# EAGLE design supply (EAGLE 5.10)
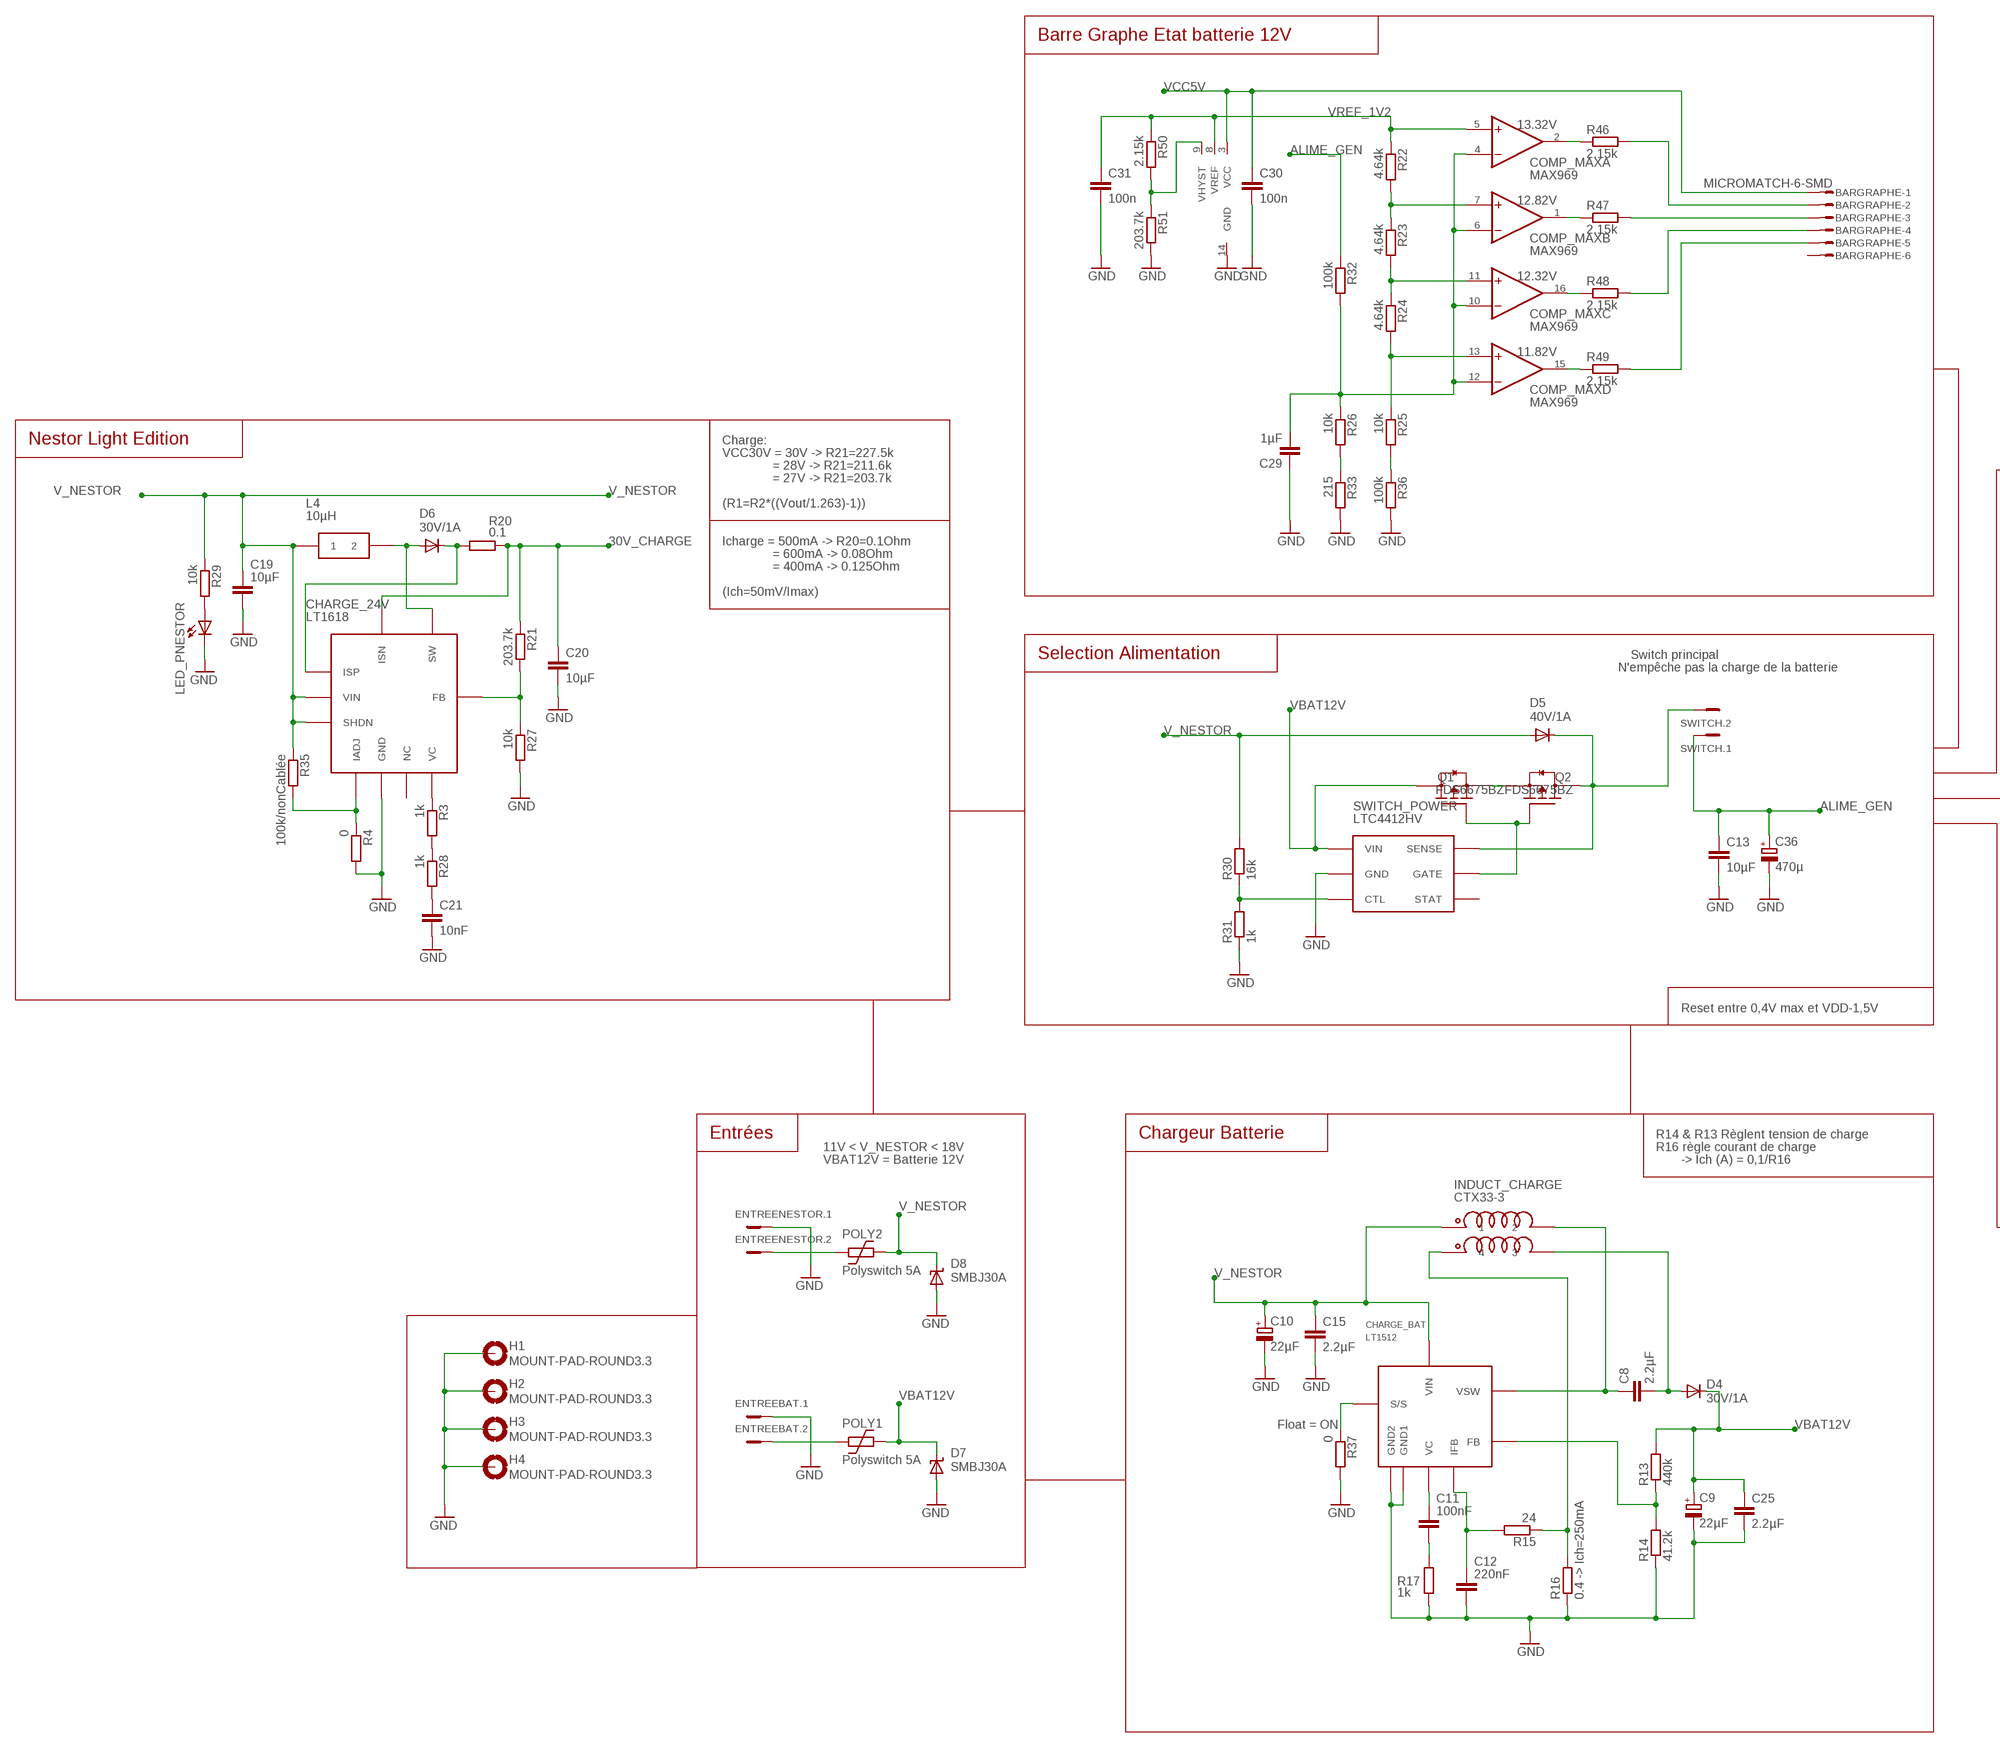
[diagram p0: schematic, sheet 1, part 1 of 2]
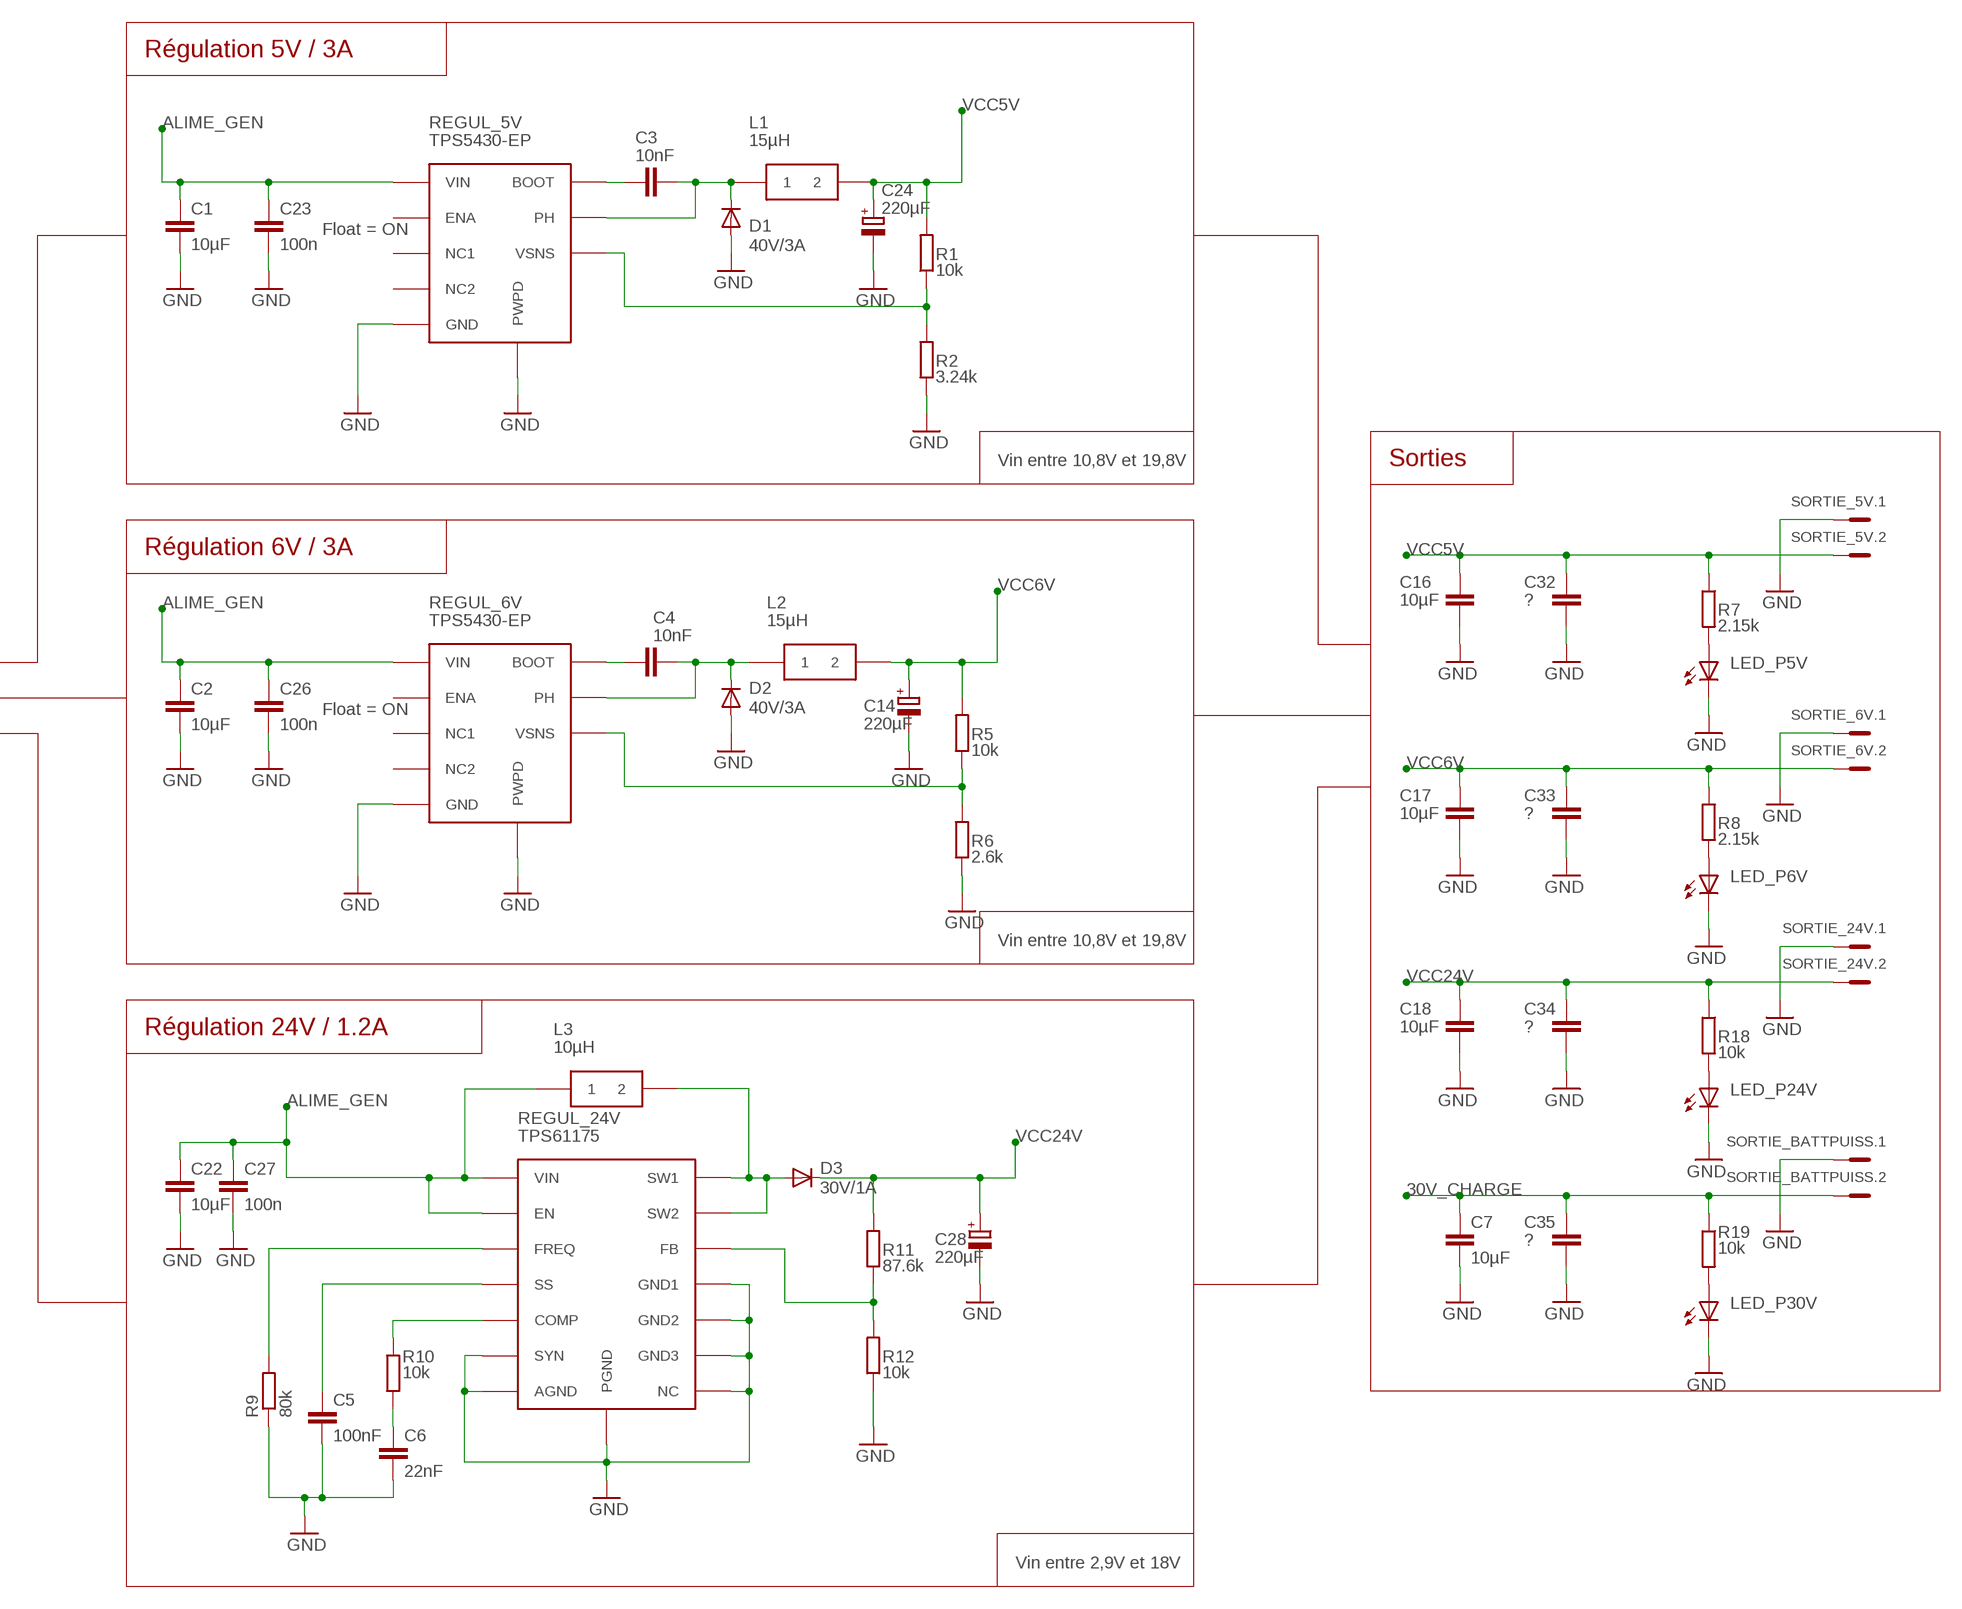
[diagram p1: schematic, sheet 1, part 2 of 2]

## Parts
BARGRAPHE  MICROMATCH-6-SMD  [MICROMATCH-6-SMD]
C1  10µF  C-EUC1210  [C1210]
C2  10µF  C-EUC1210  [C1210]
C3  10nF  C-EUC0603  [C0603]
C4  10nF  C-EUC0603  [C0603]
C5  100nF  C-EUC0603  [C0603]
C6  22nF  C-EUC0603  [C0603]
C7  10µF  C-EUC1210  [C1210]
C8  2.2µF  C-EUC0805  [C0805]
C9  22µF  CPOL-EUD/7343-31R  [D/7343-31R]
C10  22µF  CPOL-EUD/7343-31R  [D/7343-31R]
C11  100nF  C-EUC0603  [C0603]
C12  220nF  C-EUC0603  [C0603]
C13  10µF  C-EUC1210  [C1210]
C14  220µF  CPOL-EUD/7343-31R  [D/7343-31R]
C15  2.2µF  C-EUC0805  [C0805]
C16  10µF  C-EUC1210  [C1210]
C17  10µF  C-EUC1210  [C1210]
C18  10µF  C-EUC1210  [C1210]
C19  10µF  C-EUC1210  [C1210]
C20  10µF  C-EUC1210  [C1210]
C21  10nF  C-EUC0603  [C0603]
C22  10µF  C-EUC1210  [C1210]
C23  100n  C-EUC0603  [C0603]
C24  220µF  CPOL-EUD/7343-31R  [D/7343-31R]
C25  2.2µF  C-EUC0805  [C0805]
C26  100n  C-EUC0603  [C0603]
C27  100n  C-EUC0603  [C0603]
C28  220µF  CPOL-EUD/7343-31R  [D/7343-31R]
C29  1µF  C-EUC0603  [C0603]
C30  100n  C-EUC0603  [C0603]
C31  100n  C-EUC0603  [C0603]
C32  ?  C-EUC1210  [C1210]
C33  ?  C-EUC1210  [C1210]
C34  ?  C-EUC1210  [C1210]
C35  ?  C-EUC1210  [C1210]
C36  470µ  CPOL-EUE5-5  [E5-5]
CHARGE_24V  LT1618  [MSOP10]
CHARGE_BAT  LT1512  [LT1512]
COMP_MAX  MAX969  [QSOP16]
D1  40V/3A  DIODE-SMB  [SMB]
D2  40V/3A  DIODE-SMB  [SMB]
D3  30V/1A  DIODE-SMB  [SMB]
D4  30V/1A  DIODE-SMB  [SMB]
D5  40V/1A  DIODE-SMB  [SMB]
D6  30V/1A  DIODE-SMB  [SMB]
D7  SMBJ30A  SUPPRESSOR-SMBJ  [SMBJ]
D8  SMBJ30A  SUPPRESSOR-SMBJ  [SMBJ]
ENTREEBAT  MC2  [MC2]
ENTREENESTOR  MC2  [MC2]
H1  MOUNT-PAD-ROUND3.3  [3,3-PAD]
H2  MOUNT-PAD-ROUND3.3  [3,3-PAD]
H3  MOUNT-PAD-ROUND3.3  [3,3-PAD]
H4  MOUNT-PAD-ROUND3.3  [3,3-PAD]
INDUCT_CHARGE  CTX33-3  [CTX33-3]
L1  15µH  INDUCTANCE1  [INDUCTANCE]
L2  15µH  INDUCTANCE1  [INDUCTANCE]
L3  10µH  INDUCTANCE1  [INDUCTANCE]
L4  10µH  INDUCTANCE2  [INDUCTANCE2]
LED_P5V  Bling  LEDCHIPLED_1206  [CHIPLED_1206]
LED_P6V  Bling  LEDCHIPLED_1206  [CHIPLED_1206]
LED_P24V  Bling  LEDCHIPLED_1206  [CHIPLED_1206]
LED_P30V  Bling  LEDCHIPLED_1206  [CHIPLED_1206]
LED_PNESTOR  Bling  LEDCHIPLED_1206  [CHIPLED_1206]
POLY1  Polyswitch 5A  POLYSWITCH_0411/12  [0411/12]
POLY2  Polyswitch 5A  POLYSWITCH_0411/12  [0411/12]
Q1  FDS6675BZ  MOSFET-PCH_SO-8  [SOIC127P600X175-8AN]
Q2  FDS6675BZ  MOSFET-PCH_SO-8  [SOIC127P600X175-8AN]
R1  10k  R-EU_R0603  [R0603]
R2  3.24k  R-EU_R0603  [R0603]
R3  1k  R-EU_R0603  [R0603]
R4  0  R-EU_R0603  [R0603]
R5  10k  R-EU_R0603  [R0603]
R6  2.6k  R-EU_R0603  [R0603]
R7  2.15k  R-EU_R0603  [R0603]
R8  2.15k  R-EU_R0603  [R0603]
R9  80k  R-EU_R0603  [R0603]
R10  10k  R-EU_R0603  [R0603]
R11  87.6k  R-EU_R0603  [R0603]
R12  10k  R-EU_R0603  [R0603]
R13  440k  R-EU_R0603  [R0603]
R14  41.2k  R-EU_R0603  [R0603]
R15  24  R-EU_R0603  [R0603]
R16  0.4 -> Ich=250mA  R-EU_R0603  [R0603]
R17  1k  R-EU_R0603  [R0603]
R18  10k  R-EU_R0603  [R0603]
R19  10k  R-EU_R0603  [R0603]
R20  0.1  R-EU_R0603  [R0603]
R21  203.7k  R-EU_R0603  [R0603]
R22  4.64k  R-EU_R0603  [R0603]
R23  4.64k  R-EU_R0603  [R0603]
R24  4.64k  R-EU_R0603  [R0603]
R25  10k  R-EU_R0603  [R0603]
R26  10k  R-EU_R0603  [R0603]
R27  10k  R-EU_R0603  [R0603]
R28  1k  R-EU_R0603  [R0603]
R29  10k  R-EU_R0603  [R0603]
R30  16k  R-EU_R0603  [R0603]
R31  1k  R-EU_R0603  [R0603]
R32  100k  R-EU_R0603  [R0603]
R33  215  R-EU_R0603  [R0603]
R35  100k/nonCablée  R-EU_R0603  [R0603]
R36  100k  R-EU_R0603  [R0603]
R37  0  R-EU_R0603  [R0603]
R46  2.15k  R-EU_R0603  [R0603]
R47  2.15k  R-EU_R0603  [R0603]
R48  2.15k  R-EU_R0603  [R0603]
R49  2.15k  R-EU_R0603  [R0603]
R50  2.15k  R-EU_R0603  [R0603]
R51  203.7k  R-EU_R0603  [R0603]
REGUL_5V  TPS5430-EP  [TPS5430-EP]
REGUL_6V  TPS5430-EP  [TPS5430-EP]
REGUL_24V  TPS61175  [TPS61175]
SORTIE_5V  MC2  [MC2]
SORTIE_6V  MC2  [MC2]
SORTIE_24V  MC2  [MC2]
SORTIE_BATTPUISS  MC2  [MC2]
SWITCH  MC2  [MC2]
SWITCH_POWER  LTC4412HV  [LTC4412HV]

## Nets
30V_CHARGE: C7.1 C20.1 C35.1 CHARGE_24V.2(ISN) R19.1 R20.1 R21.1 SORTIE_BATTPUISS.2
ALIME_GEN: C1.1 C2.1 C13.1 C22.1 C23.1 C26.1 C27.1 C36.+ L3.P$1 R32.1 REGUL_5V.P$7(VIN) REGUL_6V.P$7(VIN) REGUL_24V.P$3(VIN) REGUL_24V.P$4(EN) SWITCH.1
GND: C1.2 C2.2 C5.2 C6.2 C7.2 C9.- C10.- C12.2 C13.2 C14.- C15.2 C16.2 C17.2 C18.2 C19.2 C20.2 C21.2 C22.2 C23.2 C24.- C25.2 C26.2 C27.2 C28.- C29.1 C30.2 C31.2 C32.2 C33.2 C34.2 C35.2 C36.- CHARGE_24V.5(GND) CHARGE_BAT.P$6(GND2) CHARGE_BAT.P$7(GND1) COMP_MAX.14(GND) D1.A D2.A D7.A D8.A ENTREEBAT.1 ENTREENESTOR.1 H1.B3,3(MOUNT) H2.B3,3(MOUNT) H3.B3,3(MOUNT) H4.B3,3(MOUNT) LED_P5V.C LED_P6V.C LED_P24V.C LED_P30V.C LED_PNESTOR.C R2.1 R4.2 R6.1 R9.1 R12.1 R14.1 R16.1 R17.1 R27.2 R31.1 R33.2 R36.2 R37.2 R51.2 REGUL_5V.P$6(GND) REGUL_5V.P$9(PWPD) REGUL_6V.P$6(GND) REGUL_6V.P$9(PWPD) REGUL_24V.P$6(SYN) REGUL_24V.P$7(AGND) REGUL_24V.P$11(NC) REGUL_24V.P$12(GND1) REGUL_24V.P$13(GND2) REGUL_24V.P$14(GND3) REGUL_24V.P$15(PGND) SORTIE_5V.1 SORTIE_6V.1 SORTIE_24V.1 SORTIE_BATTPUISS.1 SWITCH_POWER.P$2(GND)
N$2: C4.1 REGUL_6V.P$1(BOOT)
N$3: C3.1 REGUL_5V.P$1(BOOT)
N$4: C3.2 D1.C L1.P$1 REGUL_5V.P$8(PH)
N$5: R1.1 R2.2 REGUL_5V.P$4(VSNS)
N$6: C4.2 D2.C L2.P$1 REGUL_6V.P$8(PH)
N$7: R5.1 R6.2 REGUL_6V.P$4(VSNS)
N$8: CHARGE_24V.10(VC) R3.1
N$9: R11.1 R12.2 REGUL_24V.P$9(FB)
N$10: D3.A L3.P$2 REGUL_24V.P$1(SW1) REGUL_24V.P$2(SW2)
N$11: C8.1 CHARGE_BAT.P$8(VSW) INDUCT_CHARGE.P$2
N$12: R9.2 REGUL_24V.P$10(FREQ)
N$13: C5.1 REGUL_24V.P$5(SS)
N$14: C8.2 D4.A INDUCT_CHARGE.P$3
N$15: INDUCT_CHARGE.P$4 R15.1 R16.2
N$16: C6.1 R10.1
N$17: R10.2 REGUL_24V.P$8(COMP)
N$18: C11.1 CHARGE_BAT.P$1(VC)
N$19: C11.2 R17.2
N$20: COMP_MAX.7(B:+IN) R22.2 R23.1
N$21: ENTREENESTOR.2 POLY2.1
N$22: C12.1 CHARGE_BAT.P$3(IFB) R15.2
N$23: Q1.4(G) Q2.4(G) SWITCH_POWER.P$5(GATE)
N$24: LED_P5V.A R7.2
N$25: LED_P6V.A R8.2
N$26: CHARGE_BAT.P$2(FB) R13.1 R14.2
N$27: COMP_MAX.2(A:OUT) R46.1
N$28: LED_P24V.A R18.2
N$29: COMP_MAX.11(C:+IN) R23.2 R24.1
N$30: COMP_MAX.13(D:+IN) R24.2 R25.1
N$31: COMP_MAX.9(VHYST) R50.2 R51.1
N$32: C29.2 COMP_MAX.4(A:-IN) COMP_MAX.6(B:-IN) COMP_MAX.10(C:-IN) COMP_MAX.12(D:-IN) R26.1 R32.2
N$33: LED_P30V.A R19.2
N$34: CHARGE_24V.4(IADJ) R4.1 R35.2
N$35: CHARGE_BAT.P$4(S/S) R37.1
N$36: C21.1 R28.2
N$37: COMP_MAX.1(B:OUT) R47.1
N$38: CHARGE_24V.1(FB) R21.2 R27.1
N$39: ENTREEBAT.2 POLY1.1
N$40: LED_PNESTOR.A R29.2
N$41: R30.1 R31.2 SWITCH_POWER.P$3(CTL)
N$43: Q1.1(S) Q2.1(S)
N$45: R26.2 R33.1
N$46: R25.2 R36.1
N$47: R3.2 R28.1
N$48: CHARGE_24V.3(ISP) D6.C R20.2
N$50: CHARGE_24V.7(SW) D6.A L4.P$2
N$55: COMP_MAX.16(C:OUT) R48.1
N$56: BARGRAPHE.2 R46.2
N$57: BARGRAPHE.3 R47.2
N$58: BARGRAPHE.4 R48.2
N$61: COMP_MAX.15(D:OUT) R49.1
N$62: BARGRAPHE.5 R49.2
V_NESTOR: C10.+ C15.1 C19.1 CHARGE_24V.8(VIN) CHARGE_24V.9(SHDN) CHARGE_BAT.P$5(VIN) D5.A D8.C INDUCT_CHARGE.P$1 L4.P$1 POLY2.2 R29.1 R30.2 R35.1
VBAT12V: C9.+ C25.1 D4.C D7.C POLY1.2 Q1.5(D) R13.2 SWITCH_POWER.P$1(VIN)
VCC5V: BARGRAPHE.1 C16.1 C24.+ C30.1 C32.1 COMP_MAX.3(VCC) L1.P$2 R1.2 R7.1 SORTIE_5V.2
VCC6V: C14.+ C17.1 C33.1 L2.P$2 R5.2 R8.1 SORTIE_6V.2
VCC12V_1: D5.C Q2.5(D) SWITCH.2 SWITCH_POWER.P$6(SENSE)
VCC24V: C18.1 C28.+ C34.1 D3.C R11.2 R18.1 SORTIE_24V.2
VREF_1V2: C31.1 COMP_MAX.5(A:+IN) COMP_MAX.8(VREF) R22.1 R50.1
Unconnected: BARGRAPHE.6 CHARGE_24V.6(NC) REGUL_5V.P$2(NC1) REGUL_5V.P$3(NC2) REGUL_5V.P$5(ENA) REGUL_6V.P$2(NC1) REGUL_6V.P$3(NC2) REGUL_6V.P$5(ENA) SWITCH_POWER.P$4(STAT)

## Notes on the sheet
- Barre Graphe Etat batterie 12V
- 13.32V
- 12.82V
- 12.32V
- Régulation 5V / 3A
- 11.82V
- Nestor Light Edition | Charge:
- VCC30V = 30V -> R21=227.5k
- = 28V -> R21=211.6k | Float = ON
- = 27V -> R21=203.7k
- (R1=R2*((Vout/1.263)-1))
- Icharge = 500mA -> R20=0.1Ohm
- = 600mA -> 0.08Ohm
- = 400mA -> 0.125Ohm
- (Ich=50mV/Imax)
- Vin entre 10,8V et 19,8V | Sorties
- Selection Alimentation | Switch principal
- N'empêche pas la charge de la batterie
- Régulation 6V / 3A
- Float = ON
- Vin entre 10,8V et 19,8V
- Reset entre 0,4V max et VDD-1,5V
- Régulation 24V / 1.2A
- Entrées | Chargeur Batterie | R14 & R13 Règlent tension de charge
- 11V < V_NESTOR < 18V | R16 règle courant de charge
- VBAT12V = Batterie 12V | -> Ich (A) = 0,1/R16
- Vin entre 2,9V et 18V
- Float = ON

## Library data of the parts
BARGRAPHE = apbteam_con-amp-micromatch:MICROMATCH-6: MicroMaTch 6
C1-C8 C11-C13 C15-C23 C25-C27 C29-C35 = rcl:C-EU: CAPACITOR, European symbol
C9 C10 C14 C24 C28 C36 = rcl:CPOL-EU: POLARIZED CAPACITOR, European symbol
CHARGE_24V = apbTeam:LT1618
CHARGE_BAT = apbTeam:LT1512
COMP_MAX = maxim-7:MAX969
D1-D6 = diode:DIODE-: DIODE
D7 D8 = diode:SUPPRESSOR-: Suppressor diode
ENTREEBAT ENTREENESTOR SORTIE_5V SORTIE_6V SORTIE_24V SORTIE_BATTPUISS SWITCH = con-phoenix-381_l:MC2: Mini-Combicon 3.81mm horizontal 2-polig MC 1,5/2-G-3,81 Artikel-Nr. 1803277
H1-H4 = holes:MOUNT-PAD-ROUND: MOUNTING PAD, round
INDUCT_CHARGE = apbTeam:CTX33-3
L1-L3 = apbTeam:INDUCTANCE1: 12x12 mm
L4 = apbTeam:INDUCTANCE2: 6x6 mm
LED_P5V LED_P6V LED_P24V LED_P30V LED_PNESTOR = led:LED: LED OSRAM: - CHIPLED LG R971, LG N971, LY N971, LG Q971, LY Q971, LO R971, LY R971 LH N974, LH R974 LS Q976, LO Q976, LY Q976 LO Q996 - Hyper CHIPLED LW Q18S LB Q993, LB Q99A, LB R99A - SideLED LS A670, LO A670, LY A670, LG A670, LP A670 LB A673, LV A673, LT A673, LW A673 LH A674 LY A675 LS A676, LA A676, LO A676, LY A676, LW A676 LS A679, LY A679, LG A679 - Hyper Micro SIDELED® LS Y876, LA Y876, LO Y876, LY Y876 LT Y87S - SmartLED LW L88C, LW L88S LB L89C, LB L89S, LG L890 LS L89K, LO L89K, LY L89K LS L896, LA L896, LO L896, LY L896 - TOPLED LS T670, LO T670, LY T670, LG T670, LP T670 LSG T670, LSP T670, LSY T670, LOP T670, LYG T670 LG T671, LOG T671, LSG T671 LB T673, LV T673, LT T673, LW T673 LH T674 LS T676, LA T676, LO T676, LY T676, LB T676, LH T676, LSB T676, LW T676 LB T67C, LV T67C, LT T67C, LS T67K, LO T67K, LY T67K, LW E67C LS E67B, LA E67B, LO E67B, LY E67B, LB E67C, LV E67C, LT E67C LW T67C LS T679, LY T679, LG T679 LS T770, LO T770, LY T770, LG T770, LP T770 LB T773, LV T773, LT T773, LW T773 LH T774 LS E675, LA E675, LY E675, LS T675 LS T776, LA T776, LO T776, LY T776, LB T776 LHGB T686 LT T68C, LB T68C - Hyper Mini TOPLED® LB M676 - Mini TOPLED Santana® LG M470 LS M47K, LO M47K, LY M47K Source: http://www.osram.convergy.de/
POLY1 POLY2 = apbteam_polyswitch:POLYSWITCH_: POLYSWITCH
Q1 Q2 = FairChild-transistor:MOSFET-PCH_
R1-R33 R35-R37 R46-R51 = rcl:R-EU_: RESISTOR, European symbol
REGUL_5V REGUL_6V = apbTeam:TPS5430-EP
REGUL_24V = apbTeam:TPS61175
SWITCH_POWER = apbTeam:LTC4412HV

## Board
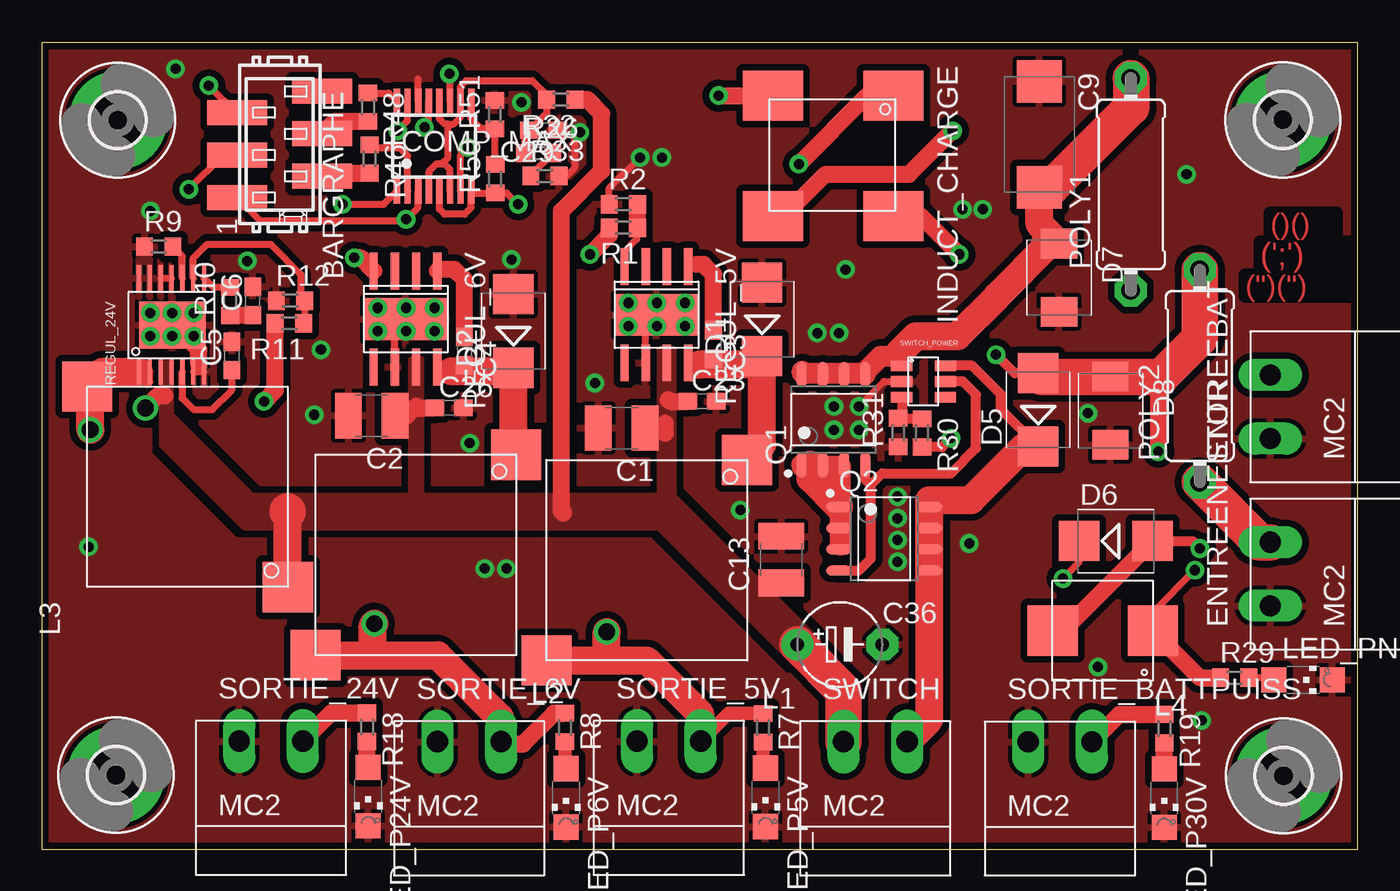
[diagram p2: board, top side]
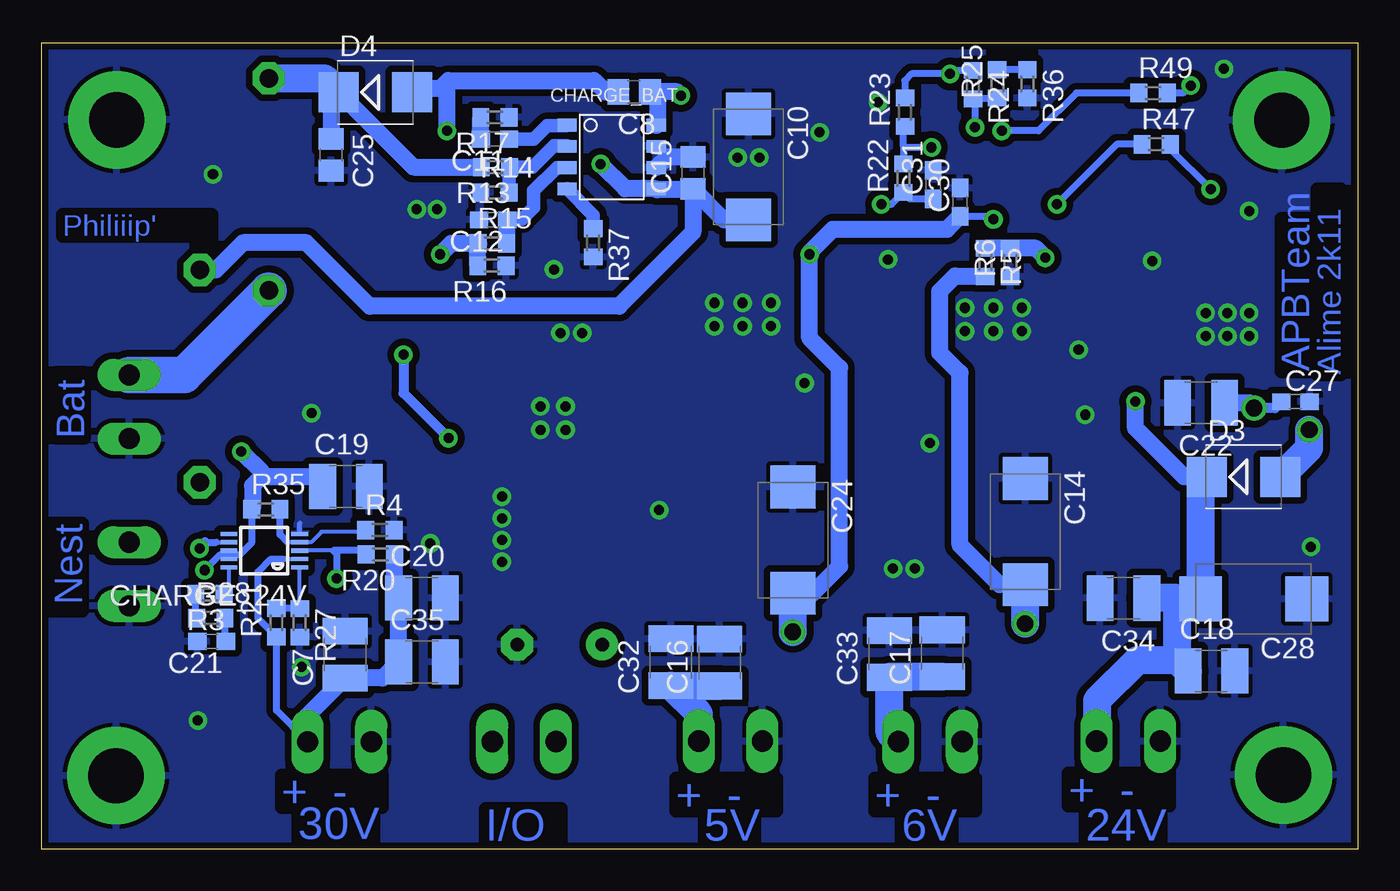
[diagram p3: board, bottom side, seen from below]

Size 78.74 x 48.26 mm. Coordinates in mm from the lower left corner, seen from the top.
Outline: 0,0 78.74,0 78.74,48.26 0,48.26 0,0
Copper layers (1*16): Top 0.035mm / dielectric 1.5mm / Bottom 0.035mm
Design rules "SparkFun_dru": minimum track width 8mil, minimum drill 20mil, track to track 8mil, track to pad 8mil, pad to pad 8mil, via to via 8mil, smd to smd 8mil, copper to edge 10mil, drill to drill 8mil, minimum pad ring 12mil, minimum via ring 10mil, stop-mask expansion 4mil, vias tented up to drill 25mil, thermal gap 10mil

### Footprints (pad centres in the part's own frame; a part is rotated, then mirrored left to right if it is on the bottom)
MICROMATCH-6-SMD = smd 1.5 x 3.58: 1 3.175,-2.54; 2 1.905,2.54; 3 0.635,-2.54; 4 -0.635,2.54; 5 -1.905,-2.54; 6 -3.175,2.54
C1210 = smd 1.6 x 2.7: 1 -1.4,0; 2 1.4,0
C0603 = smd 1.1 x 1: 1 -0.85,0; 2 0.85,0
C0805 = smd 1.3 x 1.5: 1 -0.95,0; 2 0.95,0
D/7343-31R = smd 2.55 x 2.7: + 3.175,0; - -3.175,0
E5-5 = drill 0.813 pad 1.905 round: + -2.54,0 | drill 0.813 pad 1.905 octagon: - 2.54,0
MSOP10 = smd 0.25 x 1: 1 -1,-2.113; 2 -0.5,-2.113; 3 0,-2.113; 4 0.5,-2.113; 5 1,-2.113; 6 1,2.113; 7 0.5,2.113; 8 0,2.113; 9 -0.5,2.113; 10 -1,2.113
LT1512 = smd 1.143 x 0.762: P$1 -2.794,1.778; P$2 -2.794,0.508; P$3 -2.794,-0.762; P$4 -2.794,-2.032; P$5 2.54,-2.032; P$6 2.54,-0.762; P$7 2.54,0.508; P$8 2.54,1.778
QSOP16 = smd 0.381 x 1.524: 1 -2.223,-2.69; 2 -1.587,-2.69; 3 -0.953,-2.69; 4 -0.318,-2.69; 5 0.318,-2.69; 6 0.953,-2.69; 7 1.587,-2.69; 8 2.223,-2.69; 9 2.223,2.69; 10 1.587,2.69; 11 0.953,2.69; 12 0.318,2.69; 13 -0.318,2.69; 14 -0.953,2.69; 15 -1.587,2.69; 16 -2.223,2.69
SMB = smd 2.4 x 2.4: A 2.2,0; C -2.2,0
SMBJ = smd 1.78 x 2.16: A 2.04,0; C -2.03,0
MC2 = drill 1.27 long: 1 -1.905,0; 2 1.905,0
3,3-PAD = drill 3.3 pad 5.842 round: B3,3 0,0
CTX33-3 = smd 3 x 3.6: P$1 -3.6,3.6; P$2 -3.6,-3.6; P$3 3.6,-3.6; P$4 3.6,3.6
INDUCTANCE = smd 3 x 3: P$1 -6,-6; P$2 6,6
INDUCTANCE2 = smd 3 x 3: P$1 -3,0; P$2 3,0
CHIPLED_1206 = smd 1.5 x 1.5: A 0,-1.75; C 0,1.75
0411/12 = drill 1.1 pad 1.93 octagon: 1 -6.35,0; 2 6.35,0
SOIC127P600X175-8AN = smd 1.55 x 0.6: 1 -2.7,1.905; 2 -2.7,0.635; 3 -2.7,-0.635; 4 -2.7,-1.905; 5 2.7,-1.905; 6 2.7,-0.635; 7 2.7,0.635; 8 2.7,1.905
R0603 = smd 1 x 1.1: 1 -0.85,0; 2 0.85,0
TPS5430-EP = smd 2.2 x 0.5: P$1 -0.88,4.39; P$2 -0.88,3.12; P$3 -0.88,1.85; P$4 -0.88,0.58; P$5 4.87,0.58; P$6 4.87,1.85; P$7 4.87,3.12; P$8 4.87,4.39 | smd 2.5 x 5: P$9 2,2.5
TPS61175 = smd 1.55 x 0.25: P$1 -2.8,1.9; P$2 -2.8,1.25; P$3 -2.8,0.6; P$4 -2.8,-0.05; P$5 -2.8,-0.7; P$6 -2.8,-1.35; P$7 -2.8,-2; P$8 2.8,-2; P$9 2.8,-1.35; P$10 2.8,-0.7; P$11 2.8,-0.05; P$12 2.8,0.6; P$13 2.8,1.25; P$14 2.8,1.9 | smd 2.8 x 4: P$15 0,-0.1
LTC4412HV = smd 1.27 x 0.635: P$1 -1.4,0.8; P$2 -1.4,-0.15; P$3 -1.4,-1.1; P$4 1.22,-1.1; P$5 1.22,-0.15; P$6 1.22,0.8

### Placement (x,y rotation side)
BARGRAPHE  14.24,42.18 270 top
C1  34.7,25.2 180 top
C2  19.75,25.94 180 top
C3  40.2,30.2 270 top
C4  25.29,29.82 270 top
C5  11.38,29.53 90 top
C6  12.63,32.82 90 top
C7  60.59,11.65 90 bottom
C8  43.3,45.32 180 bottom
C9  59.69,42.78 270 top
C10  36.45,40.83 270 bottom
C11  51.63,42.5 180 bottom
C12  51.73,37.67 180 bottom
C13  44.25,17.33 90 top
C14  19.88,19.01 270 bottom
C15  39.78,40.48 90 bottom
C16  38.18,11.17 90 bottom
C17  24.86,11.73 90 bottom
C18  8.76,10.66 0 bottom
C19  60.54,21.71 0 bottom
C20  55.99,15.03 0 bottom
C21  68.58,12.44 180 bottom
C22  9.37,26.72 180 bottom
C23  39.5,26.8 0 top
C24  33.8,18.5 270 bottom
C25  61.44,41.56 270 bottom
C26  24.38,26.41 0 top
C27  3.73,26.78 0 bottom
C28  6.23,14.98 180 bottom
C29  30.02,43.03 180 top
C30  23.8,38.73 90 bottom
C31  25.39,39.78 90 bottom
C32  41.1,11.2 90 bottom
C33  28.02,11.69 90 bottom
C34  14.02,15.03 180 bottom
C35  55.99,11.21 0 bottom
C36  47.75,12.25 0 top
CHARGE_24V  65.43,17.87 90 bottom
CHARGE_BAT  44.52,41.55 0 bottom
COMP_MAX  23.48,42.08 0 top
D1  43.1,31.7 90 top
D2  28.22,31.01 90 top
D3  6.83,22.28 0 bottom
D4  58.78,45.3 0 bottom
D5  59.62,26.29 90 top
D6  64.27,18.44 0 top
D7  60.87,34.21 270 top
D8  63.95,26.24 270 top
ENTREEBAT  73.5,26.48 90 top
ENTREENESTOR  73.5,16.47 90 top
H1  4.44,4.44 0 top
H2  74.3,4.4 0 top
H3  4.55,43.63 0 top
H4  74.25,43.65 0 top
INDUCT_CHARGE  47.35,41.49 270 top
L1  36.2,17.3 180 top
L2  22.38,17.61 180 top
L3  8.73,21.68 90 top
L4  63.48,13.08 180 top
LED_P5V  43.31,3.1 180 top
LED_P6V  31.38,3.08 180 top
LED_P24V  19.53,3.16 180 top
LED_P30V  67.16,3.06 180 top
LED_PNESTOR  75.48,10.14 270 top
POLY1  65.16,39.79 90 top
POLY2  69.29,28.32 90 top
Q1  47.37,25.71 90 top
Q2  50.4,18.59 0 top
R1  34.8,37.2 180 top
R2  34.8,38.6 0 top
R3  68.67,15.26 180 bottom
R4  58.51,19.1 0 bottom
R5  22.29,35.12 270 bottom
R6  20.79,35.12 90 bottom
R7  43.16,7.27 270 top
R8  31.31,7.29 270 top
R9  7,36.06 0 top
R10  11.27,32.78 90 top
R11  14.82,31.47 180 top
R12  14.88,32.83 0 top
R13  51.6,40.82 180 bottom
R14  51.63,39.3 0 bottom
R15  51.78,36.25 0 bottom
R16  51.8,34.92 180 bottom
R17  51.63,43.8 180 bottom
R18  19.46,7.3 270 top
R19  67.17,7.22 270 top
R20  58.48,17.64 180 bottom
R21  64.7,13.56 90 bottom
R22  27.18,40.16 90 bottom
R23  27.09,44.11 90 bottom
R24  23.02,45.76 270 bottom
R25  21.57,45.81 90 bottom
R26  29.73,41.66 0 top
R27  63.3,13.55 270 bottom
R28  68.62,13.84 0 bottom
R29  71.38,10.26 0 top
R30  52.67,24.92 270 top
R31  51.25,24.93 90 top
R32  31.05,44.86 180 top
R33  30.11,40.29 0 top
R35  65.33,20.34 0 bottom
R36  19.77,45.81 270 bottom
R37  45.75,36.3 270 bottom
R46  19.61,41.31 270 top
R47  12.06,42.19 0 bottom
R48  19.52,44.41 270 top
R49  12.24,45.26 0 bottom
R50  27.14,40.13 90 top
R51  27.11,43.97 90 top
REGUL_5V  34.29,33.98 270 top
REGUL_6V  19.28,33.73 270 top
REGUL_24V  7.72,31.38 90 top
SORTIE_5V  37.52,6.47 0 top
SORTIE_6V  25.58,6.44 0 top
SORTIE_24V  13.72,6.47 0 top
SORTIE_BATTPUISS  60.93,6.43 0 top
SWITCH  49.88,6.44 0 top
SWITCH_POWER  52.86,28.14 0 top

### Tracks (layer width: path | path; a pad name or v marks a point on that pad's centre or on a via)
30V_CHARGE
  Top 1.016: R19.1 64.47,8.07 SORTIE_BATTPUISS.2
  Bottom 0.254: 64.27,17.37 CHARGE_24V.2
  Bottom 0.406: 64.27,17.37 65.03,17.37 65.8,16.6 65.8,13.81 R21.1 64.7,8.3 SORTIE_BATTPUISS.2
  Bottom 1.016: R20.1 57.63,15.27 C20.1 C35.1 58.35,10.25 C7.1 62.83,8.01 SORTIE_BATTPUISS.2
ALIME_GEN  (via drill 1)
  Top 1.016: R32.1 32.64,44.86 33.5,44 33.5,40.6 31.1,38.2 31.1,20.3 | C2.1 21.84,25.94 22.4,26.5 22.49,26.41 C26.1 | 37.3,25.5 37.3,24.9 37,25.2 C1.1 | 37.5,26.9 37.6,26.8 C23.1 | 31.1,20.3 31.1,20.2 31.2,20.1 31.2,20.2 31.1,20.3 | v6.2,26.4 6.95,27.15 7.36,27.15
  Top 1.676: L3.P$1 14.73,20.17 14.7,20.2
  Top 2.184: SWITCH.1 47.97,9.48 C36.+ | 14.7,20.2 14.72,20.22
  Bottom 0.61: C27.1 4.96,26.4 v6.2,26.4
  Bottom 1.016: C22.1 6.52,26.72 v6.2,26.4
  pour Top (no thermals): 7.2,29.2 7.2,24.2 12.1,19.3 36.9,19.3 45.1,11.1 46.4,12.4 46.5,12.4 37.8,21.1 37.8,29.9 37,29.9 37,21.1 22.7,21.1 22.7,29.3 22.1,29.3 22.1,21.1 12.6,21.1 7.7,26 7.7,29.2
GND  (via drill 0.6)
  Top 0.305: 9.4,29 9.4,28.89 REGUL_24V.P$7
  Top 0.406: REGUL_5V.P$6 36.14,31.33 REGUL_5V.P$9 | REGUL_6V.P$6 21.1,28.88 21.1,30.7 21.5,31.1 21.6,31 v21.8,31 | COMP_MAX.14 22.52,46.08 22.5,46.1 | R33.2 31.39,40.29 31.9,40.8 31.9,42.6 v32.2,42.9 | R2.1 33.95,39.55 v35.8,41.4 | REGUL_24V.P$12 REGUL_24V.P$11 | REGUL_24V.P$6 REGUL_24V.P$7 | SWITCH_POWER.P$2 50.39,27.99 v48.9,26.5
  Top 1.016: v9.1,30.7 9.1,30.2 9.4,29.9 9.4,29
  Bottom 0.305: CHARGE_24V.5 63.32,19.48 63.3,19.5
  Bottom 1.016: C15.2 41.34,41.43 CHARGE_BAT.P$6
  other vias: 12.3,35.2 6.5,32.1 7.8,32.1 9.1,32.1 6.5,30.7 7.8,30.7 20.1,32.4 21.8,32.4 23.5,32.4 20.1,31 23.5,31 35.1,32.7 36.8,32.7 38.5,32.7 35.1,31.3 36.8,31.3 38.5,31.3 47.4,26.5 47.4,25.1 48.9,25.1 51.2,21.1 51.2,19.8 51.2,18.5 51.2,17.2 62.6,26.1 25.6,24.3 37.1,41.4 46.4,30.9 47.7,30.9 28.7,44.7 8,46.7 26.5,16.8 27.8,16.8 68.5,40.4 16.7,29.9 55.1,38.3 56.3,38.3 63.2,10.9 16.3,26 6.5,38.2 41.8,20.3 48.1,34.7 2.8,18.1 28.1,35.3 33.1,27.9 69.4,7.7 55.5,18.3
  pour Top (isolate 0.406, rank 2): 0.3,48 78.5,48 78.6,0.2 55.8,0.2 0.2,0.1 0.2,48.1
  pour Bottom (isolate 0.406): 0.4,48.1 78.6,48.1 78.6,0.2 0.3,0.2 0.3,48.2
N$1
  Top 1.27: 49.3,28.5 45.5,28.5 45.5,28.6
N$2
  Top 1.016: C4.1 25.29,34.11 24.7,34.7 23.76,34.7 REGUL_6V.P$1
N$3
  Top 0.406: 39.2,35 38.82,35 REGUL_5V.P$1
  Top 1.016: C3.1 40.2,34.4 39.6,35 39.2,35
N$4
  Top 0.406: REGUL_5V.P$8 38.77,29.2 38.97,29 39.3,29 | C3.2 40.4,29.15 40.4,29
  Top 1.676: L1.P$1 43.1,24.2 D1.C 42.6,29 40.4,29 39.3,29
N$5
  Top 0.406: REGUL_5V.P$4 34.87,35.77 35.6,36.5 35.6,37.15 R1.1
  Top 1.016: R1.1 R2.2
N$6
  Top 0.406: C4.2 25.5,28.75 25.5,28.6 | REGUL_6V.P$8 23.92,28.6 24.5,28.6
  Top 1.676: L2.P$1 28.22,23.78 D2.C 28,28.6 25.5,28.6 24.5,28.6
N$7  (via drill 0.6)
  Top 1.016: v18.7,35.4 19.06,35.4 REGUL_6V.P$4
  Bottom 1.016: R5.1 R6.2 19.27,35.97 v18.7,35.4
N$8
  Bottom 0.254: 67.54,15.54 CHARGE_24V.10
  Bottom 0.406: R3.1 67.54,15.54
N$9
  Top 0.406: REGUL_24V.P$9 9.07,35.37 9.9,36.2 13.7,36.2 15.5,34.4 15.5,33.06 R12.2 15.73,31.54 R11.1
N$10  (via drill 1)
  Top 0.406: REGUL_24V.P$2 6.47,27.97 6.3,27.8 6.3,28.09 REGUL_24V.P$1
  Top 1.676: REGUL_24V.P$1 3.62,28.58 L3.P$2 2.9,27.51 v2.9,25.1
  Bottom 1.676: v2.9,25.1 2.9,24.01 D3.A
N$11  (via drill 0.6)
  Top 1.016: INDUCT_CHARGE.P$2 40.51,45.09 v40.5,45.1
  Bottom 1.016: CHARGE_BAT.P$8 41.91,43.4 41.91,44.88 C8.1 40.72,45.32 v40.5,45.1
N$12
  Top 0.406: REGUL_24V.P$10 8.42,35.49 R9.2
N$13
  Top 0.406: REGUL_24V.P$5 8.42,27.68 8.4,27.66 8.4,27 9.1,26.3 10.2,26.3 11.38,27.48 C5.1
N$14  (via drill 0.6)
  Top 1.016: 43.75,37.25 INDUCT_CHARGE.P$3 44.39,37.89 46.9,40.4 51.9,40.4 v54.5,43
  Bottom 1.016: C8.2 45.02,45.32 45.7,46 54.42,46 54.5,45.92 | D4.A 56.35,45.52 54.9,45.52 54.5,45.92 | v54.5,43 54.5,45.92
N$15  (via drill 0.6)
  Top 1.016: v54.9,35.6 52.61,37.89 INDUCT_CHARGE.P$4
  Bottom 1.016: R15.1 52.6,36.22 | R16.2 52.65,36.23 R15.1 | R15.1 54.25,36.25 v54.9,35.6
N$16
  Top 1.016: C6.1 11.31,31.97 R10.1
N$17
  Top 0.406: 10.06,33.83 REGUL_24V.P$8 10.26,33.63 R10.2
N$18
  Bottom 0.813: C11.1 49.3,42.5 48.5,43.3 47.34,43.3 CHARGE_BAT.P$1
N$19
  Bottom 1.016: C11.2 R17.2
N$20  (via drill 0.6)
  Top 0.406: COMP_MAX.7 25.06,41.56 v25.5,42
  Bottom 0.406: R23.1 27.18,43.16 27.18,42.1 | 27.18,42.1 R22.2 | v25.5,42 27.09,42 27.18,42.1
N$21
  Top 2.184: ENTREENESTOR.2 72.88,18.37 POLY2.1
N$22
  Bottom 0.813: CHARGE_BAT.P$3 47.91,40.79 49.3,39.4 49.3,38.4 50,37.7 50.85,37.7 C12.1
  Bottom 1.016: R15.2 50.93,37.62 C12.1
N$23
  Top 0.61: SWITCH_POWER.P$5 55.11,27.99 55.9,27.2 55.9,24 54.4,22.5 50.28,22.5 49.6,21.82 | Q2.4 48.88,16.68 49.6,17.4 49.6,21.82 | 49.6,21.82 49.27,22.14 Q1.4
N$24
  Top 0.813: R7.2 43.16,5 LED_P5V.A
N$25
  Top 0.813: R8.2 31.31,4.9 LED_P6V.A
N$26
  Bottom 0.813: CHARGE_BAT.P$2 47.35,42.1 48.1,42.1 49.38,40.82 R13.1 50.78,40.79 R14.2
N$27
  Top 0.406: COMP_MAX.2 21.9,41.5 21.44,41.96 19.82,41.96 R46.1
N$28
  Top 1.016: R18.2 19.46,4.98 LED_P24V.A
N$29  (via drill 0.6)
  Top 0.406: COMP_MAX.11 24.43,46.37 v24.4,46.4
  Bottom 0.406: R23.2 27.1,44.97 27.1,46 26.7,46.4 v24.4,46.4 24.19,46.61 R24.1
N$30  (via drill 0.6)
  Top 0.406: COMP_MAX.13 23.16,43.46 v22.9,43.2
  Bottom 0.406: 22.9,44.91 R24.2 | 22.9,44.91 v22.9,43.2 | 22.9,44.91 21.61,44.91 R25.1
N$31
  Top 0.406: COMP_MAX.9 25.7,43.7 26.29,43.12 R51.1 27.11,41.01 R50.2
N$32
  Top 0.406: COMP_MAX.12 23.79,43.71 24.1,43.4 24.3,43.4 | 24.3,43.4 24.65,43.4 25.05,43.8 25.05,44.76 COMP_MAX.10 25.06,45.66 25.4,46 29.35,46 30.2,45.14 R32.2 30.2,44.06 C29.2 29.18,43.01 29.1,42.94 | COMP_MAX.6 24.43,40.67 24.1,41 23.9,41 | 23.9,41 23.6,41 23.15,40.55 COMP_MAX.4 | 23.9,41 24.3,41.4 24.3,43.4 | 29.1,42.94 28.89,42.94 R26.1 | 29.1,42.94 29.18,42.94
N$33
  Top 1.016: LED_P30V.A R19.2
N$34
  Bottom 0.254: CHARGE_24V.4 | CHARGE_24V.4 64.03,18.37 | CHARGE_24V.4 62.63,18.37 62,19 59.46,19 R4.1
  Bottom 0.406: 64.03,18.37 64.48,18.82 R35.2
N$35
  Bottom 0.813: R37.1 45.75,37.96 CHARGE_BAT.P$4
N$36
  Bottom 0.406: R28.2 67.77,12.48 C21.1
N$37  (via drill 0.6)
  Top 0.406: COMP_MAX.1 20.46,38.6 v18,38.6
  Bottom 0.406: v18,38.6 14.41,42.19 R47.1
N$38
  Bottom 0.254: 63.32,14.41 CHARGE_24V.1
  Bottom 0.406: R21.2 64.69,14.4 R27.1 63.32,14.41
N$39
  Bottom 2.184: ENTREEBAT.2 70.21,28.39 POLY1.1
N$40
  Top 0.406: LED_PNESTOR.A 73.6,10.26 R29.2
N$41
  Top 0.61: R30.1 51.26,25.77 R31.2 51.46,26 SWITCH_POWER.P$3
N$42
  Top 1.27: 45.5,22.9 47.8,22.9 47.8,18.2
N$43
  Top 1.27: Q1.1 45.98,23.01
  Top 1.676: 45.98,23.01 45.98,22.21 Q2.1
N$45
  Top 0.406: R33.1 29.25,40.33 R26.2
N$46
  Bottom 0.406: R36.1 R25.2
N$47
  Bottom 0.406: R3.2 69.52,13.89 R28.1
N$48  (via drill 0.6)
  Top 0.406: D6.C 62.07,17.17 v61.1,16.2
  Bottom 0.254: 61.3,17.87 CHARGE_24V.3
  Bottom 0.406: R20.2 59.56,17.87 61.3,17.87 61.1,17.67 v61.1,16.2
N$50  (via drill 0.6)
  Top 0.61: D6.A 68.86,18.44 v69.3,18
  Top 1.016: L4.P$2 61.11,13.08 D6.A
  Bottom 0.254: CHARGE_24V.7 68.3,18.37
  Bottom 0.406: 68.97,18.37 68.3,18.37
  Bottom 0.61: v69.3,18 69.3,18.04 68.97,18.37
N$55
  Top 0.406: R48.1 20.76,45.26 COMP_MAX.16
N$56
  Top 1.016: R46.2 16.96,40.46 BARGRAPHE.2
N$57  (via drill 0.6)
  Top 0.406: BARGRAPHE.3 10.84,41.54 v8.8,39.5
  Bottom 0.406: R47.2 11.21,41.91 v8.8,39.5
N$58
  Top 1.016: R48.2 17.52,43.56 BARGRAPHE.4
N$61  (via drill 0.6)
  Top 0.406: v21.3,43 21.89,43.59 COMP_MAX.15
  Bottom 0.406: R49.1 16.84,45.26 19.1,43 v21.3,43
N$62  (via drill 0.6)
  Top 0.406: BARGRAPHE.5 11.62,44.08 v10,45.7
  Bottom 0.406: R49.2 10.44,45.26 v10,45.7
V_NESTOR  (via drill 0.6)
  Top 0.406: L4.P$1 66.48,14.18 v69,16.7
  Top 0.61: D5.A 58.21,28.49 v57.1,29.6 | v54.4,24.6 53.87,24.07 R30.2
  Top 1.016: v45.3,41 49.39,45.09 INDUCT_CHARGE.P$1 | R29.1 69.3,10.26 L4.P$1 | v66.8,23.8 66.8,28.1 66.97,28.27
  Top 1.676: 59.84,28.27 D5.A
  Top 2.184: 59.84,28.27 D8.C 66.97,28.27 69.3,30.6 69.3,34.66 POLY2.2
  Bottom 0.254: CHARGE_24V.8 CHARGE_24V.9 67.77,17.6 67.8,17.6 68,17.6 | 66.19,18.32 66.2,18.3
  Bottom 0.406: R35.1 66.19,18.32 | 66.2,18.3 66.9,17.6 67.8,17.6 | 68,17.6 68.1,17.6 v69,16.7
  Bottom 0.61: v57.1,29.6 57.1,27.3 v54.4,24.6
  Bottom 0.813: 41.92,39.47 CHARGE_BAT.P$5
  Bottom 1.016: 41.92,39.47 39.84,39.47 C15.1 | C15.1 39.78,36.92 44.2,32.5 59.12,32.5 62.92,36.3 66.7,36.3 68.33,34.67 POLY2.2 | C10.+ 37.91,37.66 C15.1 | v45.3,41 43.82,39.52 CHARGE_BAT.P$5 | C19.1 61.94,22.3 65.59,22.3 | R35.1 66.13,20.4 66.13,21.76 65.59,22.3 | 65.59,22.3 65.59,22.59 v66.8,23.8
VBAT12V
  Top 0.61: 51.3,29.7 51.3,29.5 51.3,29.1 SWITCH_POWER.P$1
  Top 1.016: C9.+ 60.04,39.26
  Top 1.27: Q1.5 49.27,28.57 50.2,29.5 51.3,29.5
  Top 1.676: C9.+ 59.69,37.42 D7.C 60.3,36.24 | 60.3,36.24 60.01,36.24 | 51.3,29.7 52.3,30.7 54.8,30.7 57.18,33.08 57.18,33.11 60.3,36.24
  Top 2.184: C9.+ 60.41,39.61 65.2,44.4 65.2,46.1 POLY1.2
  Bottom 1.016: 52.46,40.81 R13.2 56.5,40.82 D4.C 61.6,45.3 61.44,45.13 C25.1
  Bottom 1.676: POLY1.2 61.82,46.14 D4.C
VCC5V  (via drill 0.6, 1)
  Top 0.406: COMP_MAX.3 22.51,39.37 22.51,38.41 v21.8,37.7 21.7,37.6 13.1,37.6 BARGRAPHE.1
  Top 0.813: R7.1 41.08,8.12 SORTIE_5V.2
  Top 1.016: R1.2 33.95,36.75 v32.8,35.6
  Top 1.676: SORTIE_5V.2 39.4,6.5 39.4,8.1 36.2,11.3 33.8,11.3 | L1.P$2 33.8,11.3 | 33.8,11.3 v33.8,13
  Bottom 0.406: C30.1 21.98,37.88 v21.8,37.7
  Bottom 1.016: C30.1 24.57,37.1 31.4,37.1 32.8,35.7 v32.8,35.6 32.8,30.6 31,28.8 31,16.93 32.6,15.33 C24.+
  Bottom 1.676: 41.08,9.77 C32.1 | 41.08,9.77 C16.1 | 41.08,9.77 39.43,8.12 SORTIE_5V.2 | v33.8,13 C24.+
VCC6V  (via drill 1)
  Top 1.016: R8.1 30.64,8.14 28.8,6.3 27.62,6.3 SORTIE_6V.2
  Top 1.676: SORTIE_6V.2 27.4,6.52 27.4,7.9 23.69,11.61 19.8,11.61 | L2.P$2 19.8,11.61 | v19.9,13.5 19.8,13.4 19.8,11.61
  Bottom 1.016: R5.2 22.32,34.3 24.1,34.3 25,33.4 25,29.7 23.8,28.5 23.8,18.2 21.44,15.84 C14.+
  Bottom 1.676: SORTIE_6V.2 28.02,6.97 C33.1 27.97,10.33 C17.1 | C14.+ 19.9,15.82 v19.9,13.5
VCC12V_1
  Top 0.61: SWITCH_POWER.P$6 55.66,28.94 57.4,27.2 57.4,26.31 D5.C
  Top 1.676: D5.C 58.79,24.09 55.6,20.9 53.1,20.9 Q2.5 | Q2.5 53.1,7.76 SWITCH.2 | Q2.5
VCC24V  (via drill 0.6)
  Top 1.016: R18.1 17.31,8.15 SORTIE_24V.2 | R11.2 13.97,27.47 v13.3,26.8
  Bottom 1.016: v13.3,26.8 13.3,25.2 10.38,22.28 D3.C
  Bottom 1.676: 10.8,15.03 9.44,15.03 C28.+ 9.4,21.91 D3.C | 10.8,15.03 C34.1 | C18.1 10.8,11.31 | 10.8,11.31 10.8,15.03 | 10.8,11.31 13.19,11.31 15.6,8.9 15.6,6.49 SORTIE_24V.2
VREF_1V2  (via drill 0.6)
  Top 0.406: COMP_MAX.5 23.8,38.3 24.1,38 25.3,38 25.7,38.4 COMP_MAX.8 25.81,39.28 R50.1 27.82,39.28 v28.5,38.6
  Bottom 0.406: C31.1 26.8,38.93 R22.1 27.89,38.6 v28.5,38.6

### Text on the board
Top: ()() | (';') | (")(")
Bottom: Philiiip' | APBTeam | Alime 2k11 | Bat | Nest | + - | + - | + - | + - | 30V | 24V | 6V | 5V | I/O